# Altium project Car_PCB.PrjPcb
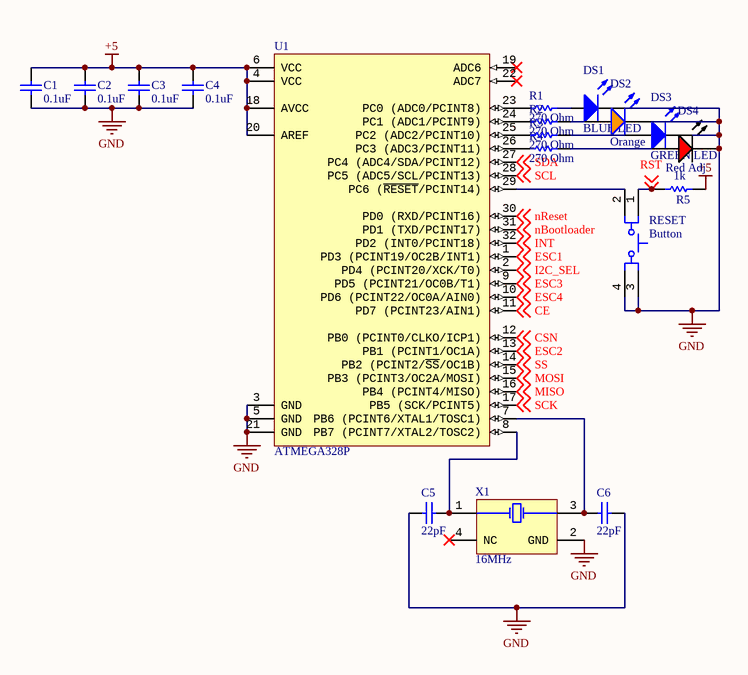
[diagram p0: [02]-IC.SchDoc]
3 sheets, 48 parts. Net scope: global (net labels, ports and power ports of the same name join across sheets).
Board file: PCBII_COPY.PcbDoc
Sheets:
  [02]-IC.SchDoc
  [03]-IMU.SchDoc
  [04]-Power.SchDoc

## Sheet [02]-IC.SchDoc: ENTER SHEET TITLE
size B; Engineer: ENTER ENGINEER NAME; Organization: CUAir; Address1: L3, 12a Rodborough Rd; Address2: Frenchs Forest; Address3: NSW; Address4: Australia 2086; Revision: ENTER REVISION NUMBER; CompetitionYear: 2019; CPN: ENTER CPN; PROJECT: ENTER PROJECT NAME

### Parts
C1  0.1uF  [CAPC2013X70X50ML10T25]
C2  0.1uF  [CAPC2013X70X50ML10T25]
C3  0.1uF  [CAPC2013X70X50ML10T25]
C4  0.1uF  [CAPC2013X70X50ML10T25]
C5  22pF  [CAPC1608X90X40ML10T20]
C6  22pF  [CAPC1608X90X40ML10T20]
DS1  BLUE LED  [0805_A]
DS2  Orange  [LTST-C171AKT_V]
DS3  GREEN LED  [LITE-ON-LTST-C191KRKT-2_V]
DS4  Red Adj  [LTST-C170KRKT_V]
R1  270 Ohm  [RESC2013X50X40NL20T20]
R2  270 Ohm  [RESC2013X50X40NL20T20]
R3  270 Ohm  [RESC2013X50X40NL20T20]
R4  270 Ohm  [RESC2013X50X40NL20T20]
R5  1k  [RESC1005X40X25NL05T10]
RESET  Button  [CKCP-PTS645S_V]
U1  ATMEGA328P  [32A_M]
X1  16MHz  [AVX-CX2520DB_V]

### Nets
+5: C1.2 C2.2 C3.2 C4.2 R5.1 U1.4(VCC) U1.6(VCC) U1.18(AVCC) U1.20(AREF)
GND: C1.1 C2.1 C3.1 C4.1 C5.1 C6.2 DS1.1(K) DS2.2(K) DS3.2(K) DS4.2(K) RESET.3 RESET.4 U1.3(GND) U1.5(GND) U1.21(GND) X1.2(GND)
CE: U1.11(PD7_(PCINT23/AIN1)) ; off-sheet CE
CSN: U1.12(PB0_(PCINT0/CLKO/ICP1)) ; off-sheet CSN
ESC1: U1.1(PD3_(PCINT19/OC2B/INT1)) ; off-sheet ESC1
ESC2: U1.13(PB1_(PCINT1/OC1A)) ; off-sheet ESC2
ESC3: U1.9(PD5_(PCINT21/OC0B/T1)) ; off-sheet ESC3
ESC4: U1.10(PD6_(PCINT22/OC0A/AIN0)) ; off-sheet ESC4
I2C_SEL: U1.2(PD4_(PCINT20/XCK/T0)) ; off-sheet I2C_SEL
INT: U1.32(PD2_(INT0/PCINT18)) ; off-sheet INT
MISO: U1.16(PB4_(PCINT4/MISO)) ; off-sheet MISO
MOSI: U1.15(PB3_(PCINT3/OC2A/MOSI)) ; off-sheet MOSI
nBootloader: U1.31(PD1_(TXD/PCINT17)) ; off-sheet nBootloader
nReset: U1.30(PD0_(RXD/PCINT16)) ; off-sheet nReset
RST: R5.2 RESET.1 ; off-sheet RST
SCK: U1.17(PB5_(SCK/PCINT5)) ; off-sheet SCK
SCL: U1.28(PC5_(ADC5/SCL/PCINT13)) ; off-sheet SCL
SDA: U1.27(PC4_(ADC4/SDA/PCINT12)) ; off-sheet SDA
SS: U1.14(PB2_(PCINT2/~{SS}/OC1B)) ; off-sheet SS
NetC5_2: C5.2 U1.8(PB7_(PCINT7/XTAL2/TOSC2)) X1.1(HOT)
NetC6_1: C6.1 U1.7(PB6_(PCINT6/XTAL1/TOSC1)) X1.3(HOT)
NetDS1_2: DS1.2(A) R1.2
NetDS2_1: DS2.1(A) R2.2
NetDS3_1: DS3.1(A) R3.2
NetDS4_1: DS4.1(A) R4.2
NetR1_1: R1.1 U1.23(PC0_(ADC0/PCINT8))
NetR2_1: R2.1 U1.24(PC1_(ADC1/PCINT9))
NetR3_1: R3.1 U1.25(PC2_(ADC2/PCINT10))
NetR4_1: R4.1 U1.26(PC3_(ADC3/PCINT11))
NetRESET_2: RESET.2 U1.29(PC6_(~{RESET}/PCINT14))

Not connected (* = marked no-connect by the designer): U1 19(ADC6)* 22(ADC7)*; X1 4(NC)*

### Notes on the sheet
- Project
- Title
- Size:
- Date:
- B
- Number:
- Revision:
- File:

### Library data of the parts
C1-C4 = CMP-2000-05001-1: Chip Capacitor, 0.1 uF, -20% to 80%, 50 V, -30 to 85 degC, 0805 (2012 Metric), RoHS, Tape and Reel; Manufacturer: Yageo; MPN: CC0805ZRY5V9BB104; Capacitance: 0.1µF; Catalog Drawings: CC_0805_0.6; Featured Product: CommodityMultilayerCeramicCapacitors–CCSeries; Other Names: 311-1361-6; Tolerance: -20%,+80%; Voltage - Rated: 50V; Temperature Coefficient: Y5V(F); Online Catalog: CCSeries; Features: -; Operating Temperature: -30degC~85degC; Packaging: Digi-Reel; Height - Seated (Max): -; Category: Capacitors; Lead Spacing: -; Mounting Type: SurfaceMount,MLCC; Lead Style: -; Datasheet Version: Rev. 5, 07/2010; Series: CC; Manufacturer URL: http://www.yageo.com/; Package Reference: 0805 (2012 Metric); Package Description: 2-Pin Surface Mount Device, Body 2 x 1.25 mm; Ratings: -; Applications: GeneralPurpose; Family: CeramicCapacitors; Package / Case: 0805(2012Metric); Datasheet URL: http://download.siliconexpert.com/pdfs/2012/8/14/1/40/50/201/yageo_/manual/upy-gphc_y5v_6.3v-to-50v_5_revised.pdf; Standard Package: 1; Value: 0.1uF
C5 C6 = CMP-1659-00006-3: Chip Capacitor, 22 pF, +/- 5%, 50 V, -55 to 125 degC, 0603 (1608 Metric), RoHS, Tape and Reel; MPN: CC0603JRNP09BN220; Manufacturer: Yageo; Mount: Surface Mount; PackageReference: 0603; DatasheetVersion: Rev. 13, 05/2016; RoHSCompliant: true; PackageDescription: 2-Pin Surface Mount Device, Body 1.6 x 0.8 mm; Min Operating Temperature: -55 degC; Length: 1.6 mm; Mounting Technology: Surface Mount; Max Operating Temperature: 125 degC; Value: 22pF
DS1 = CMP-1426-00008-1: SMD mono-color Chip LED, WL-SMCW, Blue; Manufacturer: Wuerth Elektronik; PartNumber: 150080BS75000; Color: Blue; ComponentLink2URL: http://katalog.we-online.com/led/datasheet/150080BS75000.pdf; ComponentLink1URL: http://www.we-online.com; ComponentLink2Description: Datasheet; PackageReference: 0805_A; ComponentLink1Description: Manufacturer URL
DS2 = CMP-1674-00004-5: LED Uni-Color Orange, 100 mW, 120 mA, -55 to 85 degC, 2-Pin SMD, RoHS, Tape and Reel; Manufacturer: Lite-On; MPN: LTST-C171AKT; ComponentLink1URL: http://www.us.liteon.com/; ComponentLink2Description: Datasheet; Packaging: Tape and Reel; Mount: Surface Mount; RoHSCompliant: true; Colour: Orange; Min Operating Temperature: -55 degC; ComponentLink2URL: http://optoelectronics.liteon.com/upload/download/DS-22-99-0170/S_110_LTST-C171AKT.pdf; Package Quantity: 3000; Height: 0.8 mm; Max Operating Temperature: 85 degC; ComponentLink1Description: Manufacturer URL; PackageReference: C171AKT; PackageDescription: 2-Pin Surface Mount Device, Body 2 x 1.25 mm; DatasheetVersion: 03/2014; Length: 2 mm; Mounting Technology: Surface Mount; Pins: 2
DS3 = CMP-2000-05198-1: Chip LED, Green, 574 nm, 40 pF, -55 to 85 degC, 2-Pin SMD, RoHS, Tape and Reel; Manufacturer: Lite-On; MPN: LTST-C191KGKT; Rad Hardened: No; Emitting Color: YellowGreen; Product Height (mm): 0.55mm; Forward Voltage: 2.4V; Number of Elements: 1; Dominant Wave Length: 571nm; DELETED: Compliant; Viewing Angle: 130deg; High Brightness: Yes; Peak Wavelength: 574nm; Type: Uni-Color; Forward Current: 30mA; Product Length (mm): 1.6mm; Luminous Intensity: 35mcd; Test Current (It): 20mA; Chip Material: AlGaInP; Product Depth (mm): 0.8mm; Shape Type: Rectangular; Reverse Voltage: 5V; Power Dissipation: 75W; Pin Count: 2; Lens Dimensions: 1.1X0.8X0.37mm; Packaging: TapeandReel; Main Category: ChipLED; Operating Temperature Classification: Industrial; Package Type: ChipLed; Mounting: SurfaceMount; Lum Intensity: 35mcd; Operating Temp Range: -55Cto85C; Datasheet Version: Jan-07; Datasheet URL: http://download.siliconexpert.com/pdfs/2007/08/26/semi_b/manual/lot/ds/ltst-c191kgkt.pdf; Manufacturer URL: http://www.us.liteon.com/
DS4 = CMP-2000-07593-1: LED Red, 75 mW, 54 mcd, -55 to 85 degC, 2-Pin SMD, RoHS, Tape and Reel; Manufacturer: Lite-On; Lens Transparency: Clear; Number of Elements: 1; Power Rating: 75mW; Luminous Intensity: 54mcd; Viewing Angle: 130degrees; Forward Current: 30mA; Wavelength: 639nm; Lens Style: Rectangular; Case\/Package: 0805; Test Current: 20mA; Dominant Wavelength: 631nm; Forward Voltage: 2V; Lens Colour: Colorless; Min Operating Temperature: -55degC; RoHSCompliant: True; Length: 3.2mm; Width: 1.25mm; Mount: SurfaceMount; Packaging: TapeandReel; Number of LEDs: 1; Radiation Hardening: No; Datasheet URL: http://optoelectronics.liteon.com/upload/download/DS-22-99-0150/LTST-C170KRKT.pdf; Datasheet Version: Rev. D, 11/2014; Case Code (Metric): 2012; Height: 1.1mm; Number of Pins: 2; Package Description: 2-Pin Surface Mount Device, Body 2 x 1.25 mm; Manufacturer URL: http://www.us.liteon.com/; Lead Free: LeadFree; Illumination Colour: Red; Colour: Red; Case Code (Imperial): 0805; Max Operating Temperature: 85degC; Power Dissipation: 75mW; Mounting Technology: SurfaceMount; Package Reference: C170KRKT; Package Quantity: 1; Depth: 1.6mm
R1-R4 = CMP-2001-03354-1: 270 Ohm Resistor; Part Number: RR1220P-271-D; Manufacturer: Susumu; Value: 270 Ohm
R5 = CMP-2002-07472-1: MPN: RC0402FR-071KL; Manufacturer: Yageo / Phycomp; Value: 1k
RESET = CMP-2000-07594-1: Tact Switch, SPST-NO, 50 mA, -20 to 60 degC, 4-Pin SMD, RoHS, Tape and Reel; Manufacturer: C&K Components; MPN: PTS645SM43SMTR92 LFS; Actuator Length: 0.85mm; Voltage Rating (DC): 12V; Mechanical Life: 100000Cycles; Illumination Type: Illuminated; Throw Configuration: SPST; Switch Function: Off-Mom; Actuator Material: Polyamide; Contact Resistance: 100mOhm; Max Current Rating: 50mA; Operating Force: 160gf; Case\/Package: SMD/SMT; Orientation: Straight; RoHSCompliant: True; Manufacturer URL: http://www.ckswitches.com/; Package Quantity: 1000; Datasheet URL: http://www.ckswitches.com/media/1471/pts645.pdf; Colour: Black; Min Operating Temperature: -20degC; Length: 6mm; Mount: SurfaceMount; Depth: 9mm; Max Voltage Rating (DC): 12V; Package Reference: PTS645S; REACH SVHC: NoSVHC; Contact Material: Silver; Packaging: TapeandReel; Package Description: 4-Pin Surface Mount Device, Body 6 x 6 mm, Pitch 4.5 mm; Max Operating Temperature: 60degC; Lead Free: LeadFree; Termination: GullWing; Current Rating: 50mA; Datasheet Version: 04/2016; Mounting Technology: SurfaceMount; Contact Plating: Silver; Value: Button
U1 = CMP-0095-00269-2: 8-bit AVR Microcontroller, 32KB Flash, 1KB EEPROM, 2KB SRAM, 32-pin TQFP, Industrial Grade (-40°C to 85°C); MPN: ATmega328P-AU; Manufacturer: Microchip Technology; PackageDescription: 32-Lead, 7x7x1.0 mm Body, 0.8mm Lead Pitch, Thin Profile Plastic Quad Flat Package (TQFP); DatasheetVersion: revD, May-2011; RevisionNote: DatasheetVersion & PackageVersion updated. URLs added.; ComponentLink1URL: http://www.atmel.com/; ComponentLink2Description: ATmega48A/48PA/88A/88PA/168A/168PA/328/328P Datasheet; Code_JEDEC: MS-026-ABA; ComponentLink1Description: Manufacturer URL; PackageReference: 32A; ComponentLink3Description: ATmega48A/48PA/88A/88PA/168A/168PA/328/328P Summary; ComponentLink2URL: http://www.atmel.com/dyn/resources/prod_documents/doc8271.pdf; PackageVersion: revC, Oct-2010; ComponentLink3URL: http://www.atmel.com/dyn/resources/prod_documents/8271S.pdf; Value: ATMEGA328P
X1 = CMP-2000-06128-1: Crystal, 16 MHz, 8 pF, -10 to 70 degC, 4-Pin SMD, RoHS, Tape and Reel; Manufacturer: AVX; MPN: CX2520DB16000D0GEJCC; ESR: 80Ohms; Frequency Stability: 15PPM; Load Capacitance: 8pF; Unit Weight: 0.000459oz; Qualification: AEC-Q200; Drive Level: 10uW; Brand: AVX/Kyocera; Manufacturer URL: http://global.kyocera.com/; Factory Pack Quantity: 3000; Length: 2.5mm; Frequency: 16MHz; Package Reference: CX2520DB; Product Category: Crystals; Width: 2mm; Mounting Technology: SurfaceMount; Packaging: Reel; Termination Style: SMD/SMT; Mounting Style: SMD/SMT; RoHS: True; Package Description: 4-Pin Surface Mount Device, Body 2.5 x 2 mm, Pitch 1.7 mm; Datasheet URL: http://www.kyocera-crystal.jp/eng/wp-content/uploads/2014/12/cx2520db_e.pdf; Datasheet Version: 09/2015; Package / Case: 2.5mmx2mm; Height: 0.5mm; Tolerance: 15PPM; Type: SMDCrystal; Series: CX2520DB; Operating Temperature Range: -10Cto+70C; Value: 16MHz

## Sheet [03]-IMU.SchDoc: ENTER SHEET TITLE
size B; Engineer: ENTER ENGINEER NAME; Organization: CUAir; Address1: L3, 12a Rodborough Rd; Address2: Frenchs Forest; Address3: NSW; Address4: Australia 2086; Revision: ENTER REVISION NUMBER; CompetitionYear: 2019; CPN: ENTER CPN; PROJECT: ENTER PROJECT NAME
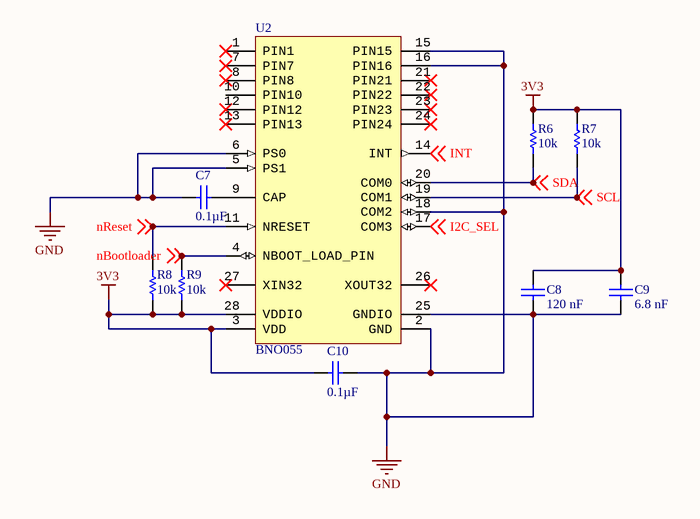
[diagram p1: [03]-IMU.SchDoc]

### Parts
C7  Capacitance: 0.1µF  [CAPC2013X145X20ML20]  (hidden comment: C2012X7R2A104K125AA)
C8  value 120 nF  [CAPC1005X55X25ML05T10]  (hidden comment: GRM155R71H123KA12D)
C9  value 6.8 nF  [CAPC0603X33X15NL03T05]  (hidden comment: GRM033R71A682KA01D)
C10  Capacitance: 0.1µF  [CAPC2013X145X20ML20]  (hidden comment: C2012X7R2A104K125AA)
R6  Resistance: 10k  [RESC2013X60X35ML10T20]  (hidden comment: RC0805JR-0710KL)
R7  Resistance: 10k  [RESC2013X60X35ML10T20]  (hidden comment: RC0805JR-0710KL)
R8  Resistance: 10k  [RESC2013X60X35ML10T20]  (hidden comment: RC0805JR-0710KL)
R9  Resistance: 10k  [RESC2013X60X35ML10T20]  (hidden comment: RC0805JR-0710KL)
U2  BNO055  [BOSC-LGA-28_M]

### Nets
3V3: C8.2 C9.2 C10.2 R6.2 R7.2 R8.1 R9.1 U2.3(VDD) U2.28(VDDIO)
GND: C7.2 C8.1 C9.1 C10.1 U2.2(GND) U2.5(PS1) U2.6(PS0) U2.15(PIN15) U2.16(PIN16) U2.18(COM2) U2.25(GNDIO)
I2C_SEL: U2.17(COM3) ; off-sheet I2C_SEL
INT: U2.14(INT) ; off-sheet INT
nBootloader: R9.2 U2.4(NBOOT_LOAD_PIN) ; off-sheet nBootloader
nReset: R8.2 U2.11(NRESET) ; off-sheet nReset
SCL: R7.1 U2.19(COM1) ; off-sheet SCL
SDA: R6.1 U2.20(COM0) ; off-sheet SDA
NetC7_1: C7.1 U2.9(CAP)

Not connected (* = marked no-connect by the designer): U2 1(PIN1)* 7(PIN7)* 8(PIN8)* 10(PIN10) 12(PIN12)* 13(PIN13)* 21(PIN21)* 22(PIN22)* 23(PIN23)* 24(PIN24)* 26(XOUT32)* 27(XIN32)*

### Notes on the sheet
- Project
- Title
- Size:
- Date:
- B
- Number:
- Revision:
- File:

### Library data of the parts
C7 C10 = CMP-2000-05453-1: Chip Capacitor, 100 nF, +/- 10%, 100 V, -55 to 1255 degC, 0805 (2012 Metric), RoHS, Tape and Reel; Manufacturer: TDK; PCN Part Number: MLCCPartNumberChange30/Nov/2012; Temperature Coefficient: X7R; Voltage - Rated: 100V; Kits: SAMPLEKIT1008-ND-KITCAPCERMLCC100V-630V; Other Names: 445-1418-1; Online Catalog: CSeries,MidVoltage; Featured Product: C-SeriesMidVoltageMLCCs; Catalog Drawings: CSERIES_2012-0805_1.45; Product Training Modules: HighCapacitanceReplacementSEAT,CCV,andTVCLDesignToolsGuidetoReplacinganElectrolyticCapacitorwithanMLCC; Applications: GeneralPurpose; Datasheet Version: Jul-13; Mounting Type: SurfaceMount,MLCC; Height - Seated (Max): -; Packaging: CutTape(CT); Datasheet URL: https://datasheet.ciiva.com/11788/0900766b80fc5cba-11788142.pdf; Tolerance: ±10%; Package Reference: 805; Manufacturer URL: http://www.tdk.com/; Thickness (Max): 0.057"(1.45mm); Series: C; Lead Style: -; Operating Temperature: -55degC~125degC; Category: Capacitors; Package Description: 2-Pin Surface Mount Device, Body 2 x 1.25 mm; Standard Package: 1; Package / Case: 0805(2012Metric); Family: CeramicCapacitors; RoHS Information: RoHSCertificate-MLCC; Size / Dimension: 0.079"Lx0.049"W(2.00mmx1.25mm); Lead Spacing: -; Ratings: -; Features: -
C8 = CMP-2008-03957-1: 120 nF Capacitor; Manufacturer: Murata; Part Number: GRM155R71H123KA12D
C9 = CMP-2010-01688-1: Manufacturer: Murata; Part Number: GRM033R71A682KA01D
R6-R9 = CMP-2000-05025-1: Chip Resistor, 10 KOhm, +/- 5%, 0.125 W, -55 to 155 degC, 0805 (2012 Metric), RoHS, Tape and Reel; Manufacturer: Yageo; Resistor Element Type: ThickFilm; Voltage Rating: 150V; Product Range: RCSeries; SVHC: ToBeAdvised; Resistor Case Style: 0805[2012Metric]; Temperature Coefficient: ±100ppm/degC; Power Rating: 250mW; Automotive Qualification Standard: -; Datasheet Version: REV. 2, 09/2004; Packaging: CutTape; Resistance Tolerance: ±5%; MSL: MSL1-Unlimited; Manufacturer URL: http://www.yageo.com/; Datasheet URL: http://www.yageo.ru/pdf/RC0805.pdf; Package Description: 2-Pin Surface Mounted Device, Body 2 x 1.25 mm; Package Reference: 805
U2 = CMP-2000-05075-1: Intelligent 9-Axis Absolute Orientation Sensor, 1.7 V to 3.6 V, -40 to 85 degC, 28-Pin LGA, RoHS, Tape and Reel; Manufacturer: Bosch Sensortec; Manufacturer URL: http://www.bosch-sensortec.com; Datasheet URL: http://datasheet.octopart.com/BNO055-Bosch-datasheet-45840915.pdf; Datasheet Version: Rev. 1.3, 08/2015

## Sheet [04]-Power.SchDoc: ENTER SHEET TITLE
size B; Engineer: ENTER ENGINEER NAME; Organization: CUAir; Address1: L3, 12a Rodborough Rd; Address2: Frenchs Forest; Address3: NSW; Address4: Australia 2086; Revision: ENTER REVISION NUMBER; CompetitionYear: 2019; CPN: ENTER CPN; PROJECT: ENTER PROJECT NAME
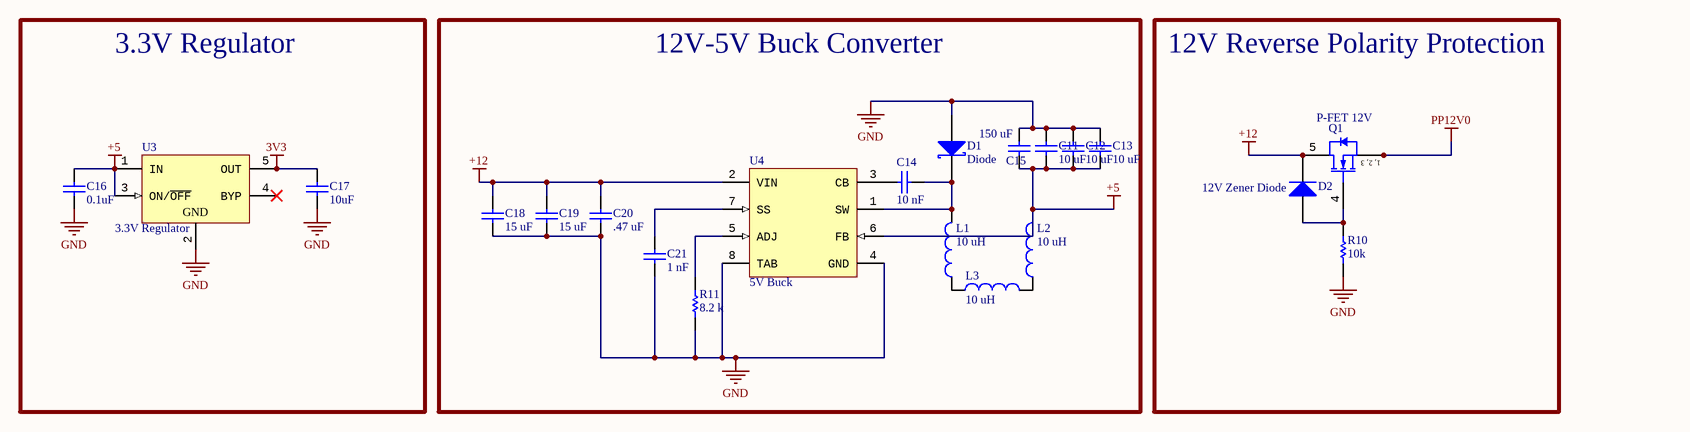
[diagram p2: [04]-Power.SchDoc]

### Parts
C11  10 uF  [CAPC1608X90X38LL10T18]
C12  10 uF  [CAPC1608X90X38LL10T18]
C13  10 uF  [CAPC1608X90X38LL10T18]
C14  10 nF  [CAPC2013X70X45ML10T25]
C15  150 uF  [CAPC3216X180X50LL20T30]
C16  0.1uF  [CAPC2013X70X50ML10T25]
C17  10uF  [CAPC2013X145X50LL20T25]
C18  15 uF  [CAPC5750X280X20LL40]
C19  15 uF  [CAPC5750X280X20LL40]
C20  .47 uF  [CAPC2013X95X50LL10T25]
C21  1 nF  [CAPC2013X70X50LL10T25]
D1  Diode  [DIOD-SMA-2_A_V]
D2  12V Zener Diode  [FAIR-DO-214AA-2_V]
L1  10 uH  [MURA-LQH32CN100K53]
L2  10 uH  [MURA-LQH32CN100K53]
L3  10 uH  [MURA-LQH32CN100K53]
Q1  P-FET 12V  [NXP-SOT669_M]
R10  10k  [RESC1005X40X25LL05T10]
R11  8.2 k  [RESC2013X50X40LL20T20]
U3  3.3V Regulator  [MF05A_M]
U4  5V Buck  [TS7B_N]

### Blocks framed on the sheet
3.3V Regulator: C16 C17 U3
12V-5V Buck Converter: C11-C15 C18-C21 D1 L1-L3 R11 U4
12V Reverse Polarity Protection: D2 Q1 R10

### Nets
3V3: C17.2 U3.5(OUT)
+5: C11.1 C12.1 C13.1 C15.1 C16.2 L2.2 U3.1(IN) U3.3(ON/~{OFF}) U4.6(FB)
+12: C18.2 C19.2 C20.1 D2.2(K) Q1.5(D) U4.2(VIN)
GND: C11.2 C12.2 C13.2 C15.2 C16.1 C17.1 C18.1 C19.1 C20.2 C21.1 D1.1(A) R10.1 R11.1 U3.2(GND) U4.4(GND) U4.8(TAB)
PP12V0: Q1.1(S) Q1.2(S) Q1.3(S)
NetC14_1: C14.1 U4.3(CB)
NetC14_2: C14.2 D1.2(K) L1.2 U4.1(SW)
NetC21_2: C21.2 U4.7(SS)
NetD2_1: D2.1(A) Q1.4(G) R10.2
NetL1_1: L1.1 L3.1
NetL2_1: L2.1 L3.2
NetR11_2: R11.2 U4.5(ADJ)

Not connected (* = marked no-connect by the designer): U3 4(BYP)*

### Notes on the sheet
- Project
- Title
- Size:
- Date:
- B
- Number:
- Revision:
- File:
- (in symbol CMP-1258-00324-1) 1, 2, 3

### Library data of the parts
C11-C13 = CMP-2000-07518-1: Chip Capacitor, 10 uF, +/- 10%, 6.3 V, -55 to 85 degC, 0603 (1608 Metric), RoHS, Tape and Reel; Manufacturer: Murata; MPN: GRM188R60J106KE47D; Voltage Rating: 6.3V; Capacitance: 10uF; Dielectric: X5R; Material: Ceramic; Datasheet Version: 03/2016; Depth: 0.8mm; Height: 0.8mm; Termination: SMD/SMT; Thickness: 0.035inch; Voltage Rating (DC): 6.3V; Package Reference: 603; Package Quantity: 4000; Weight: 0.000222oz; Manufacturer URL: http://www.murata.com/; Datasheet URL: http://search.murata.co.jp/Ceramy/image/img/A01X/G101/ENG/GRM188R60J106KE47-02.pdf; Width: 0.031inch; Min Operating Temperature: -55degC; Mounting Technology: SurfaceMount; REACH SVHC: NoSVHC; Length: 1.6mm; Case Code (Imperial): 0603; Case/Package: 0603; Case Code (Metric): 1608; RoHSCompliant: True; Tolerance: 10%; Package Description: 2-Pin Surface Mount Device, Body 1.6 x 0.8 mm; Mount: SurfaceMount; Max Operating Temperature: 85degC; Packaging: TapeandReel; Value: 10 uF
C14 = CMP-2000-05013-1: Chip Capacitor, 10 nF, +/- 10%, 50 V, -55 to 125 degC, 0805 (2012 Metric), RoHS, Tape and Reel; Manufacturer: Murata; MPN: GRM216R71H103KA01D; Voltage Rating DC: 50V; Capacitance: 0.01uF; Temperature Coefficient / Code: +/-15%; Capacitance - pF: 10000pF; Case Height: 0.6mm; Dielectric: X7R; Case Length: 2mm; Case Width: 1.25mm; Type: GeneralPurposeMLCC; Brand: MurataElectronics; Capacitance - nF: 10nF; Tolerance: 10%; Product Category: MultilayerCeramicCapacitorsMLCC-SMD/SMT; Minimum Operating Temperature: -55C; Voltage Rating: 50V; Series: GRM; Packaging: Reel; Dimensions: 1.25mmWx2mmLx0.6mmH; Operating Temperature Range: -55Cto+125C; Package / Case: 0805(2012metric); Datasheet URL: https://datasheet.ciiva.com/29201/452521-da-01-en-vs-kondensator-0805-29201121.pdf; Maximum Operating Temperature: +125C; Factory Pack Quantity: 4000; Case Code - in: 0805; Case Code - mm: 2012; Manufacturer URL: http://www.murata.com/; Termination Style: SMD/SMT; Datasheet Version: Dec-10; RoHS: Details; Product: GeneralTypeMLCCs; Value: 10 nF; URL: https://www.digikey.com/product-detail/en/murata-electronics/GRM216R71H103KA01D/490-1664-1-ND/587472
C15 = CMP-2000-06109-1: Chip Capacitor, 10 uF, +/- 10%, 35 V, 1206 (3216 Metric), RoHS, Tape and Reel; Manufacturer: Samsung Electro-Mechanics; MPN: CL32A157MQVNNNE; Temperature Coefficient: X5R; Featured Product: Multi-LayerCeramicCapacitors; Online Catalog: CLSeries,HighCapacitance; Tolerance: ±20%; Voltage - Rated: 6.3V; Product Training Modules: HighCapMLCCFamily; Capacitance: 150µF; Other Names: 1276-3367-2; Operating Temperature: -55°C~85°C; Datasheet URL: http://www.samsungsem.com/kr/support/product-search/mlcc/__icsFiles/afieldfile/2016/08/18/S_CL31B106KLHNNNE.pdf; Manufacturer URL: http://www.samsungsem.com/global/index.jsp; Package / Case: 1210(3225Metric); Datasheet Version: 07/2016; Lead Style: -; Packaging: Tape&Reel(TR); Ratings: -; Standard Package: 1,000; Package Description: 2-Pin Surface Mount Device, Body 3.2 x 1.6 mm; Size / Dimension: 0.126"Lx0.098"W(3.20mmx2.50mm); Family: CeramicCapacitors; Features: -; Height - Seated (Max): -; Applications: GeneralPurpose; Category: Capacitors; Thickness (Max): 0.110"(2.80mm); Lead Spacing: -; Mounting Technology: SurfaceMount; RoHS Information: MLCCRoHS2Compliance; Series: CL; Mounting Type: SurfaceMount,MLCC; Package Reference: 1206; Value: 150 uF
C16 = CMP-2000-05001-1: as C1 on sheet [02]-IC; Features: -; Operating Temperature: -30degC~85degC; Packaging: Digi-Reel; Height - Seated (Max): -; Category: Capacitors; Lead Spacing: -; Mounting Type: SurfaceMount,MLCC; Lead Style: -; Datasheet Version: Rev. 5, 07/2010; Series: CC; Manufacturer URL: http://www.yageo.com/; Package Reference: 0805 (2012 Metric); Package Description: 2-Pin Surface Mount Device, Body 2 x 1.25 mm; Ratings: -; Applications: GeneralPurpose; Family: CeramicCapacitors; Package / Case: 0805(2012Metric); Datasheet URL: http://download.siliconexpert.com/pdfs/2012/8/14/1/40/50/201/yageo_/manual/upy-gphc_y5v_6.3v-to-50v_5_revised.pdf; Standard Package: 1; Value: 0.1uF
C17 = CMP-2000-06077-1: Chip Capacitor, 10 uF, +/- 10%, 10 V, -55 to 85 degC, 0805 (2012 Metric), RoHS, Tape and Reel; Manufacturer: Yageo; Capacitance: 10µF; Featured Product: Yageo-HighCapacitanceMLCC; Temperature Coefficient: X5R; Voltage - Rated: 10V; Online Catalog: CCSeries; Other Names: 311-1460-6; Datasheet URL: http://www.yageo.com/documents/recent/UPY-GPHC_X5R_4V-to-50V-21.pdf; Manufacturer URL: http://www.yageo.com/; Lead Style: -; Applications: GeneralPurpose; Package / Case: 0805(2012Metric); Thickness (Max): -; Ratings: -; Mounting Type: SurfaceMount,MLCC; Height - Seated (Max): -; Series: CC; Standard Package: 1; Packaging: Digi-Reel®; Lead Spacing: -; Package Description: 2-Pin Surface Mount Device, Body 2 x 1.25 mm; Operating Temperature: -55°C~85°C; Family: CeramicCapacitors; Category: Capacitors; Datasheet Version: Rev. 21, 01/2016; Tolerance: ±10%; Mounting Technology: SurfaceMount; Features: -; Package Reference: 0805; Value: 10uF
C18 C19 = CMP-2000-07446-1: Chip Capacitor, 15 uF, +/- 20%, 100 V, -55 to 125 degC, 2220 (5750 Metric), RoHS, Tape and Reel; Manufacturer: TDK; MPN: CGA9P3X7S2A156M250KB; Dielectric: X7S; Voltage Rating: 100V; Capacitance: 15uF; Package Description: 2-Pin Surface Mount Device, Body 5.7 x 5 mm; Length: 5.7mm; Tolerance: 20%; Depth: 5mm; Min Operating Temperature: -55degC; Case Code (Imperial): 2220; Case/Package: 2220; Datasheet Version: 03/2015; REACH SVHC: NoSVHC; RoHSCompliant: True; Weight: 0.016932oz; Package Quantity: 1; Max Operating Temperature: 125degC; Voltage Rating (DC): 100V; Datasheet URL: https://product.tdk.com/info/en/catalog/datasheets/mlcc_automotive_midvoltage_en.pdf; Packaging: TapeandReel; Composition: Ceramic; Termination: SMD/SMT; Package Reference: 2220; Case Code (Metric): 5750; Thickness: 0.098inch; Mounting Technology: SurfaceMount; Lead Free: LeadFree; Height: 2.3mm; Width: 0.197inch; Manufacturer URL: http://www.tdk.com/
C20 = CMP-1660-00002-3: Chip Capacitor, 0.47 uF, +/- 10%, 16 V, -55 to 125 degC, 0805 (2012 Metric), RoHS, Tape and Reel; MPN: EMK212B7474KD-T; Manufacturer: Taiyo Yuden; Voltage Rating: 16 V; Mounting Technology: Surface Mount; Package Quantity: 4000; Packaging: Tape and Reel; Length: 2 mm; Max Operating Temperature: 125 degC; REACH SVHC: Unknown; DatasheetVersion: 06/2014; Min Operating Temperature: -55 degC; PackageDescription: 2-Pin Surface Mount Device, Body 2 x 1.25 mm; Mount: Surface Mount; Height: 0.85 mm; PackageReference: 0805 (2012 Metric); RoHSCompliant: true; URL: https://www.digikey.com/product-detail/en/taiyo-yuden/EMK212B7474KD-T/587-1282-1-ND/931059; Value: .47 uF
C21 = CMP-2000-06078-1: Chip Capacitor, 1 nF, +/- 10%, 50 V, -55 to 125 degC, 0805 (2012 Metric), RoHS, Tape and Reel; Manufacturer: Yageo; MPN: CC0805KRX7R9BB102; Product Training Modules: MultilayerCeramicCapacitors; Other Names: 311-1127-6; Capacitance: 1000pF; Temperature Coefficient: X7R; Online Catalog: CCSeries; Voltage - Rated: 50V; Featured Product: CommodityMultilayerCeramicCapacitors–CCSeries; Catalog Drawings: CC_0805_0.6; Manufacturer URL: http://www.yageo.com/; Lead Style: -; Datasheet Version: Rev. 14, 05/2016; Family: CeramicCapacitors; Package Description: 2-Pin Surface Mount Device, Body 2 x 1.25 mm; Size / Dimension: 0.079"Lx0.049"W(2.00mmx1.25mm); Category: Capacitors; Series: CC; Thickness (Max): 0.024"(0.60mm); Operating Temperature: -55°C~125°C; Height - Seated (Max): -; Package / Case: 0805(2012Metric); Features: -; Lead Spacing: -; Package Reference: 0805 (2012 Metric); Packaging: Digi-Reel®; Datasheet URL: http://www.yageo.com/documents/recent/UPY-GPHC_X7R_6.3V-to-50V_14.pdf; Mounting Type: SurfaceMount,MLCC; Applications: GeneralPurpose; Ratings: -; Standard Package: 1; Tolerance: ±10%; Mounting Technology: SurfaceMount; Value: 1 nF
D1 = CMP-2000-05897-1: Schottky Barrier Rectifier, 50 V, 3 A, -55 to 150 degC, 2-Pin SMD, RoHS, Tape and Reel; MPN: B350A-13-F; Brand: DiodesIncorporated; Ifsm - Forward Surge Current: 80A; Ir - Reverse Current: 500uA; Configuration: Single; Vf - Forward Voltage: 0.7V; If - Forward Current: 3A; Vrrm - Repetitive Reverse Voltage: 50V; Unit Weight: 0.002258oz; Technology: Si; Product Category: SchottkyDiodes&Rectifiers; Termination Style: SMD/SMT; Minimum Operating Temperature: -55C; Maximum Operating Temperature: +125C; Mounting Style: SMD/SMT; Manufacturer: DiodesIncorporated; RoHS: True; Package Reference: SMA-2; Operating Temperature Range: -55Cto+125C; Factory Pack Quantity: 5000; Mounting Technology: SurfaceMount; Product: SchottkyDiodes; Width: 2.92mm; Type: SchottkyBarrierRectifier; Series: B350; Height: 2.3mm; Package Description: 2-Pin Surface Mount Device, Body 4.3 x 2.605 mm; Packaging: Reel; Package / Case: SMA; Manufacturer URL: http://www.diodes.com/; Datasheet Version: Rev. 17-2, 09/2015; Datasheet URL: http://www.diodes.com/_files/datasheets/ds30891.pdf; Length: 4.6mm; URL: https://www.digikey.com/product-detail/en/diodes-incorporated/B350A-13-F/B350A-FDICT-ND/751529; Value: Diode
D2 = CMP-2000-07093-1: Transient Voltage Suppressor Diode, 600 W, -55 to 150 degC, 2-Pin SMB (DO-214AA), RoHS, Tape and Reel; Manufacturer: Fairchild Semiconductor; MPN: SMBJ12A; Unidirectional Channels: 1; EDA / CAD Models: DownloadfromAcceleratedDesigns; Power - Peak Pulse: 600W; Power Line Protection: No; Online Catalog: SMBJSeries; Voltage - Breakdown (Min): 13.3V; Voltage - Clamping (Max) @ Ipp: 19.9V; Other Names: SMBJ12AFSDKR; Current - Peak Pulse (10/1000µs): 30.2A; Package / Case: DO-214AA,SMB; Mounting Technology: SurfaceMount; Standard Package: 1; Type: Zener; Capacitance @ Frequency: -; Category: CircuitProtection; Supplier Device Package: DO-214AA(SMB); Mounting Type: SurfaceMount; Series: SMBJ; Family: TVS-Diodes; Datasheet Version: Rev. 1.1.1, 11/2014; Package Reference: DO-214AA-2; Package Description: 2-Pin Surface Mount Device, Body 4.4 x 3.625 mm; Packaging: Digi-Reel®; Bidirectional Channels: -; Manufacturer URL: https://www.fairchildsemi.com/; Applications: GeneralPurpose; Operating Temperature: -55°C~150°C(TJ); Voltage - Reverse Standoff (Typ): 12V; Datasheet URL: http://www.mouser.com/ds/2/149/SMBJ12A-196559.pdf; Value: 12V Zener Diode; URL: https://www.digikey.com/product-detail/en/littelfuse-inc/SMBJ12A/SMBJ12ALFCT-ND/285971
L1-L3 = CMP-2000-06583-1: Inductor, 10 uH, +/- 10%, 450 mA, -40 to 85 degC, 2-Pin SMD, RoHS, Tape and Reel; Manufacturer: Murata; MPN: LQH32CN100K53L; Frequency - Test: 1MHz; Current Rating: 450mA; Online Catalog: LQHSeries; Shielding: Unshielded; Catalog Drawings: LQH32C_53SeriesSideLQH32C_53SeriesEndLQH32C_53SeriesTop; Product Training Modules: InductorProducts; Other Names: 490-4059-2; Inductance: 10µH; Material - Core: Ferrite; DC Resistance (DCR): 390mOhmMax; Frequency - Self Resonant: 26MHz; Type: Wirewound; Package Reference: LQH32CN100K53; Manufacturer URL: http://www.murata.com/; Mounting Technology: SurfaceMount; Category: Inductors,Coils,Chokes; Size / Dimension: 0.126"Lx0.098"W(3.20mmx2.50mm); Series: LQH32C_53; Standard Package: 2,000; Operating Temperature: -40°C~85°C; Packaging: Tape&Reel(TR); Height - Seated (Max): 0.067"(1.70mm); Family: FixedInductors; Datasheet Version: 10/2016; Package Description: 2-Pin Surface Mount Device, Body 3.2 x 2.5 mm; Datasheet URL: http://psearch.en.murata.com/inductor/product/LQH32CN100K53_.pdf; Package / Case: 1210(3225Metric); Mounting Type: SurfaceMount; Tolerance: ±10%
Q1 = CMP-1258-00324-1: N-Channel Logic Level MOSFET, 80 V, 25 A, 5-Pin SOT669, Tape and Reel; Manufacturer: NXP Semiconductors; PartNumber: PSMN041-80YLX; VDS [max] (V): 80; Packing: Tape & Reel; Qr [typ] (nC): 22; Ciss [typ] (pF): 1180; VGSth [typ] (V): 1.7; ID [max] (A): 25; Channel Type: N; Coss [typ] (pF): 99; ComponentLink2Description: Datasheet; ComponentLink3Description: Package Specification; ComponentLink1URL: http://www.nxp.com/; PackageDescription: 4-Pin Plastic Single-ended Surface Mounted Package, Body 4.9 x 3.95 mm, Pitch 1.27 mm; ComponentLink3URL: http://www.nxp.com/documents/outline_drawing/sot669_po.pdf; PackageReference: SOT669; ComponentLink1Description: Manufacturer URL; PackageVersion: 13-02-27, 02/2013; Code_JEDEC: MO-235; Mounting Technology: Surface Mount; ComponentLink2URL: http://www.nxp.com/documents/data_sheet/PSMN041-80YL.pdf; MPN: PSMN041-80YLX; Value: P-FET 12V; URL: https://www.digikey.com/product-detail/en/nexperia-usa-inc/PSMN041-80YLX/1727-1507-1-ND/4486641
R10 = CMP-2002-07353-1: Part Number: RC0402FR-0710KL; Manufacturer: Yageo / Phycomp; MPN: RC0402FR-0710KL; Value: 10k; URL: https://www.digikey.com/product-detail/en/yageo/RC0402FR-0710KL/311-10.0KLRCT-ND/729470
R11 = CMP-2001-03516-1: MPN: RR1220P-822-D; Manufacturer: Susumu; URL: https://www.digikey.com/product-detail/en/susumu/RR1220P-822-D/RR12P8.2KDCT-ND/432852; Value: 8.2 k
U3 = CMP-0062-01890-1: Micropower 50 mA Ultra Low-Dropout Regulator, 5-pin SOT-23; Manufacturer: National Semiconductor; MPN: LP2982AIM5-3.3/NOPB; PowerWise: N; PackageTopMarking: L19A*XTT; CompType: LDO IC; DatasheetVersion: Feb-2006; PinCount: 5; RoHS: N; PackageReference: MF05A; PackageDescription: Molded SOT-23, .115 x .063 x .040 in Body, 5 Lead, .0375 in Pitch; PackageVersion: revD, Aug-2008; URL: https://www.digikey.com/product-detail/en/texas-instruments/LP2982AIM5-3.3-NOPB/LP2982AIM5-3.3-NOPBCT-ND/364560; Value: 3.3V Regulator
U4 = CMP-0069-00173-2: 3A Step-Down Voltage Regulator with Adjustable Current Limit, 7-pin TO-263; Manufacturer: Texas Instruments; MPN: LM2673S-5.0/NOPB; CompType: Switcher; PowerWise: N; PackageTopMarking: NSUZXYTTE#*LM2673*S-5.0; PackageDescription: TO-263, Molded, .400 x .390 x .180in Body, 7 Lead, .050in Pitch, Surface Mount; ComponentLink2Description: LM2673 Web Page; ComponentLink1URL: http://www.national.com/ds/LM/LM2673.pdf; ComponentLink3URL: http://www.national.com/packaging/folders/ts7b.html; RevisionNote: Component URLs added; ComponentLink2URL: http://www.national.com/pf/LM/LM2673.html; PinCount: 7; ComponentLink3Description: TS7B Package Page; PackageReference: TS7B; RoHS: N; PackageVersion: revE, Jul-2003; Code_JEDEC: MO-169-AC; ComponentLink1Description: LM2673 Datasheet; DatasheetVersion: Feb-2008; URL: https://www.digikey.com/product-detail/en/texas-instruments/LM2673S-5.0/LM2673S-5.0-ND/3701220; Value: 5V Buck

## Nets that join several sheets
3V3: [03]-IMU (9 pins), [04]-Power (C17.2 U3.5)
+5: [02]-IC (9 pins), [04]-Power (9 pins)
GND: [02]-IC (16 pins), [03]-IMU (11 pins), [04]-Power (16 pins)
I2C_SEL: [02]-IC (U1.2), [03]-IMU (U2.17)
INT: [02]-IC (U1.32), [03]-IMU (U2.14)
nBootloader: [02]-IC (U1.31), [03]-IMU (R9.2 U2.4)
nReset: [02]-IC (U1.30), [03]-IMU (R8.2 U2.11)
SCL: [02]-IC (U1.28), [03]-IMU (R7.1 U2.19)
SDA: [02]-IC (U1.27), [03]-IMU (R6.1 U2.20)